# Altium schematic sheet 5_STM32KIT_Peripheral.SchDoc
size A; SheetNumber: 4; SheetTotal: 4
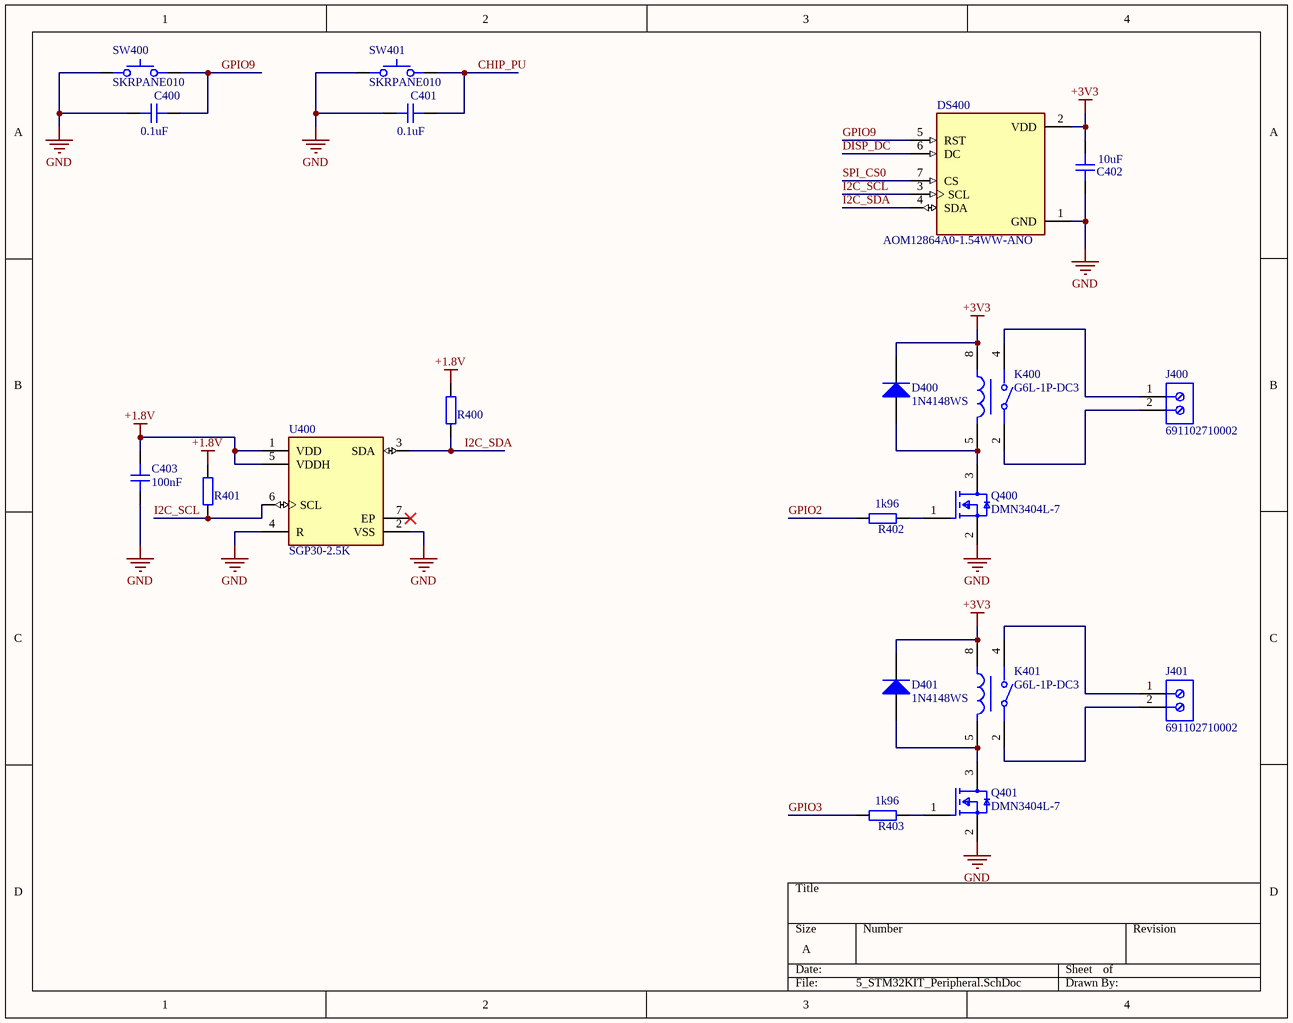
[diagram p0: 5_STM32KIT_Peripheral.SchDoc]

## Parts
C400  0.1uF  [CAP_0402]
C401  0.1uF  [CAP_0402]
C402  10uF  [CAP_0402]
C403  100nF  [CAP_0402]
D400  1N4148WS  [FAIR-SOD-323_V]
D401  1N4148WS  [FAIR-SOD-323_V]
DS400  AOM12864A0-1.54WW-ANO  [LCD_AOM12864A0-1.54WW-ANO]
J400  691102710002  [691102710002]
J401  691102710002  [691102710002]
K400  G6L-1P-DC3  [FP-G6L-1P-DC3-MFG]
K401  G6L-1P-DC3  [FP-G6L-1P-DC3-MFG]
Q400  DMN3404L-7  [FP-SOT23-MFG]
Q401  DMN3404L-7  [FP-SOT23-MFG]
R400  RES_0402  [RES_0402]  (value not drawn)
R401  RES_0402  [RES_0402]  (value not drawn)
R402  1k96  [RES_0402]
R403  1k96  [RES_0402]
SW400  SKRPANE010  [SKRPANE010]
SW401  SKRPANE010  [SKRPANE010]
U400  SGP30-2.5K  [FP-SGP30-2_5K-MFG]

## Nets
+1.8V: C403.2 R400.2 R401.2 U400.1(VDD) U400.5(VDDH)
+3V3: C402.2 D400.2(K) D401.2(K) DS400.2(VDD) K400.8 K401.8
GND: C400.1 C401.1 C402.1 C403.1 DS400.1(GND) Q400.2(S) Q401.2(S) SW400.34 SW401.34 U400.2(VSS) U400.4(R)
CHIP_PU: C401.2 SW401.12
DISP_DC: DS400.6(DC)
GPIO2: R402.1
GPIO3: R403.1
GPIO9: C400.2 DS400.5(RST) SW400.12
I2C_SCL: DS400.3(SCL) R401.1 U400.6(SCL)
I2C_SDA: DS400.4(SDA) R400.1 U400.3(SDA)
SPI_CS0: DS400.7(CS)
NetD400_1: D400.1(A) K400.5 Q400.3(D)
NetD401_1: D401.1(A) K401.5 Q401.3(D)
NetJ400_1: J400.1 K400.4
NetJ400_2: J400.2 K400.2
NetJ401_1: J401.1 K401.4
NetJ401_2: J401.2 K401.2
NetQ400_1: Q400.1(G) R402.2
NetQ401_1: Q401.1(G) R403.2

Not connected (* = marked no-connect by the designer): U400 7(EP)*

## Library data of the parts
C400-C403 = CMP-001-00086-1: Capacitor SMD 0402; Manufacturer: *; Distributor Link: *; Manufacturer Part Number: *; Design Item ID: CAP_0402; Dielectric: *; LCSC: *; Source: Schematic-Lib-PhilsLab.SchLib; Rating: *
D400 D401 = CMP-004-00001-2: Small Signal Diode, 75 V, 0.15 A, -55 to 150 degC, 2-Pin SOD-323, RoHS, Tape and Reel; Manufacturer: Fairchild; Recovery Time: 4ns; Forward Voltage: 1V; Peak Reverse Current: 5uA; Forward Current: 150mA; Capacitance: -323f; Datasheet URL: https://www.fairchildsemi.com/datasheets/1N/1N4148WS.pdf; Package Reference: SOD-323; Package Description: 2-Pin Small Outline Diode Flat Lead, Body 1.7 x 1.25 mm; Case/Package: SOD-323; Mounting Technology: SM; Manufacturer URL: https://www.fairchildsemi.com/; Pins: 2; Packaging: TapeandReel; Package Quantity: 3000; Min Operating Temperature: -55°C; RoHS Compliant: True; Max Operating Temperature: 150°C; Datasheet Version: Rev. 1.2, 03/2015
DS400 = CMP-007-00037-1: Non-Touch Graphic LCD Display Module - White OLED SPI 1.54 (39.12mm) 128 x 64; MF: Orient Display; Availability: In Stock; Pins: 7; MP: AOM12864A0-1.54WW-ANO; Check_prices: https://www.snapeda.com/parts/AOM12864A0-1.54WW-ANO/Orient+Display/view-part/?ref=eda; Case/Package: None; Value: *; Purchase-URL: https://pricing.snapeda.com/search/part/AOM12864A0-1.54WW-ANO/?ref=eda; Component Type: Standard; Source: AOM12864A0-1.54WW-ANO.SchLib; Design Item ID: AOM12864A0-1.54WW-ANO; SnapEDA_Link: https://www.snapeda.com/parts/AOM12864A0-1.54WW-ANO/Orient+Display/view-part/?ref=snap; Price: None
J400 J401 = CMP-1502-03258-2: NexarPartId: 8917706; Number of Levels: 1; Number of Positions Per Level: 2; Current: 15A; Voltage: 300V; Pitch: 5.0038mm; Plating: Steel; Stripping Length: -6mm; Wire Gauge (Min): 14AWG; Wire Gauge (Max): 22AWG; Length: 7.5mm; Contact Material: Brass; Contact Plating: Tin; Packaging: Box; Number of Pins: 2; Voltage Rating: 300V; Termination: Screw; Number of Contacts: 2; Color: Blue; Current Rating: 15A; Mount: Through Hole; Max Operating Temperature: 105°C; Min Operating Temperature: -40°C; REACH SVHC: Unknown; Height: 13.4mm; Width: 11.2mm; Housing Material: Nylon; RoHS: Compliant; Wire/Cable Gauge: 22AWG; Lead Pitch: 5mm
K400 K401 = CMP-08823-000074-1: RELAY TELECOM SPST 1A 3VDC; Release Time: 5ms; Coil Resistance: 50R; Approvals: UL; Power Rating: 180mW; Coil Voltage (DC): 3V; Voltage Rating (AC): 125V; Life (Hours): 100000Hour; Coil Current: 60mA; Max Voltage Rating (DC): 60V; Coil Type: Non-Latching; Application(s): SIGNAL; Relay Type: Telecom; Length: 10.6mm; Series: G6L; Max Operating Temperature: 70°C; Mount: Through Hole; Operate Time: 5ms; Throw Configuration: SPST; RoHS Compliant: Yes; Packaging: Rail/Tube; Current Rating: 1A; Depth: 7mm; Height: 4.1mm; Min Operating Temperature: -40°C; Power Consumption: 180mW; Contact Material: Silver; Contact Current Rating: 1A; Max Current Rating: 1A; Weight: 0.021164oz; Lead Free: Lead Free; Package Quantity: 1000; Max Voltage Rating (AC): 125V; Coil Power: 180mW; Number of Pins: 4; Termination: PC Pin
Q400 Q401 = CMP-12801-000054-1: MOSFET N-CH 30V 5.8A SOT-23; Manufacturer: Diodes Inc.; Gate Charge At Vgs: 11.3nC @ 10V; Number Of Channels: 1; Depletion Mode: False; Threshold Vgs Min: 1V; Max Junction Temp: +150°C; Automotive Grade: NA; Power Dissipation: 0.72W; Turn On Delay Time: 3.41ns; Drain To Source Resistance: 24mΩ; Continuous Drain Current: 4.2A; Gate To Source Voltage: 20V; Input Capacitace At Vds: 498pF @ 15V; Rthja Max: 173°C/W; Typ Forward Diode Voltage: 0.75V; Standoff Height: 0.013mm; Turn Off Delay Time: 13.92ns; Threshold Vgs Max: 2V; Pulse Drain Current: 30A; Category: Trans; Manufacturer Part Number: DMN3404L-7; Device Class L2: Transistors; Device Class L1: Discrete Semiconductors; RoHS: TRUE; Height: 1.1mm; Footprint Url: https://www.diodes.com/assets/Package-Files/SOT23.pdf; Temperature Range Low: -55°C; ComponentLink2Description: Datasheet; Package: SOT23; Mouser Description: N-Channel 30 V 28 mOhm Surface Mount Enhancement Mode Mosfet - SOT-23-3; Drain To Source Voltage: 30V; Device Class L3: MOSFETs; Temperature Range High: +150°C; Temperature: -55°C to +150°C; Drain To Source Breakdown Voltage: 30V; Digikey Description: MOSFET N-CH 30V 5.8A SOT-23; Automotive: No; ComponentLink2URL: https://www.diodes.com/assets/Datasheets/ds31787.pdf; Octopart: https://octopart.com/dmn3404l-7-diodes+inc.-12409285; Number Of N Channels: 1; Max Forward Diode Voltage: 1V; Lead Free: Yes
R400-R403 = CMP-009-00182-1: Resistor SMD 0402; Distributor Link: *; Source: Schematic-Lib-PhilsLab.SchLib; Manufacturer Part Number: *; LCSC: *; Design Item ID: RES_0402; Manufacturer: *
SW400 SW401 = SKRPANE010: Tactile Switch SMD SPST; Manufacturer: Alps Alpine; Manufacturer Part Number: SKRPANE010; LCSC: C470426
U400 = CMP-144026-000002-1: AIR QUALITY GAS SENSOR FOR VOC'S; Manufacturer: Sensirion; Min Supply Voltage: 1.62V; Sensor Output: I2C; Operating Supply Current: 48.8mA; Max Supply Voltage: 1.98V; Category: IC; Automotive: No; Device Class L3: unset; Device Class L1: Sensors; Device Class L2: unset; Temperature Range High: +85°C; Manufacturer Part Number: SGP30-2.5K; Octopart: https://octopart.com/sgp30-2.5k-sensirion-84561789; Height: 0.9mm; Temperature: -40°C to +85°C; Lead Free: Yes; Package: SGP30-2.5K; Temperature Range Low: -40°C; Digikey Description: AIR QUALITY GAS SENSOR FOR VOC'S; RoHS: TRUE; ComponentLink2Description: Datasheet; ComponentLink2URL: https://www.sensirion.com/fileadmin/user_upload/customers/sensirion/Dokumente/0_Datasheets/Gas/Sensirion_Gas_Sensors_SGP30_Datasheet.pdf